# Altium schematic sheet Sensors.SchDoc: IMU Design
size A4; Author: Group 6; DrawnBy: Group 6; Revision: Final Submission; SheetNumber: 1; SheetTotal: 2
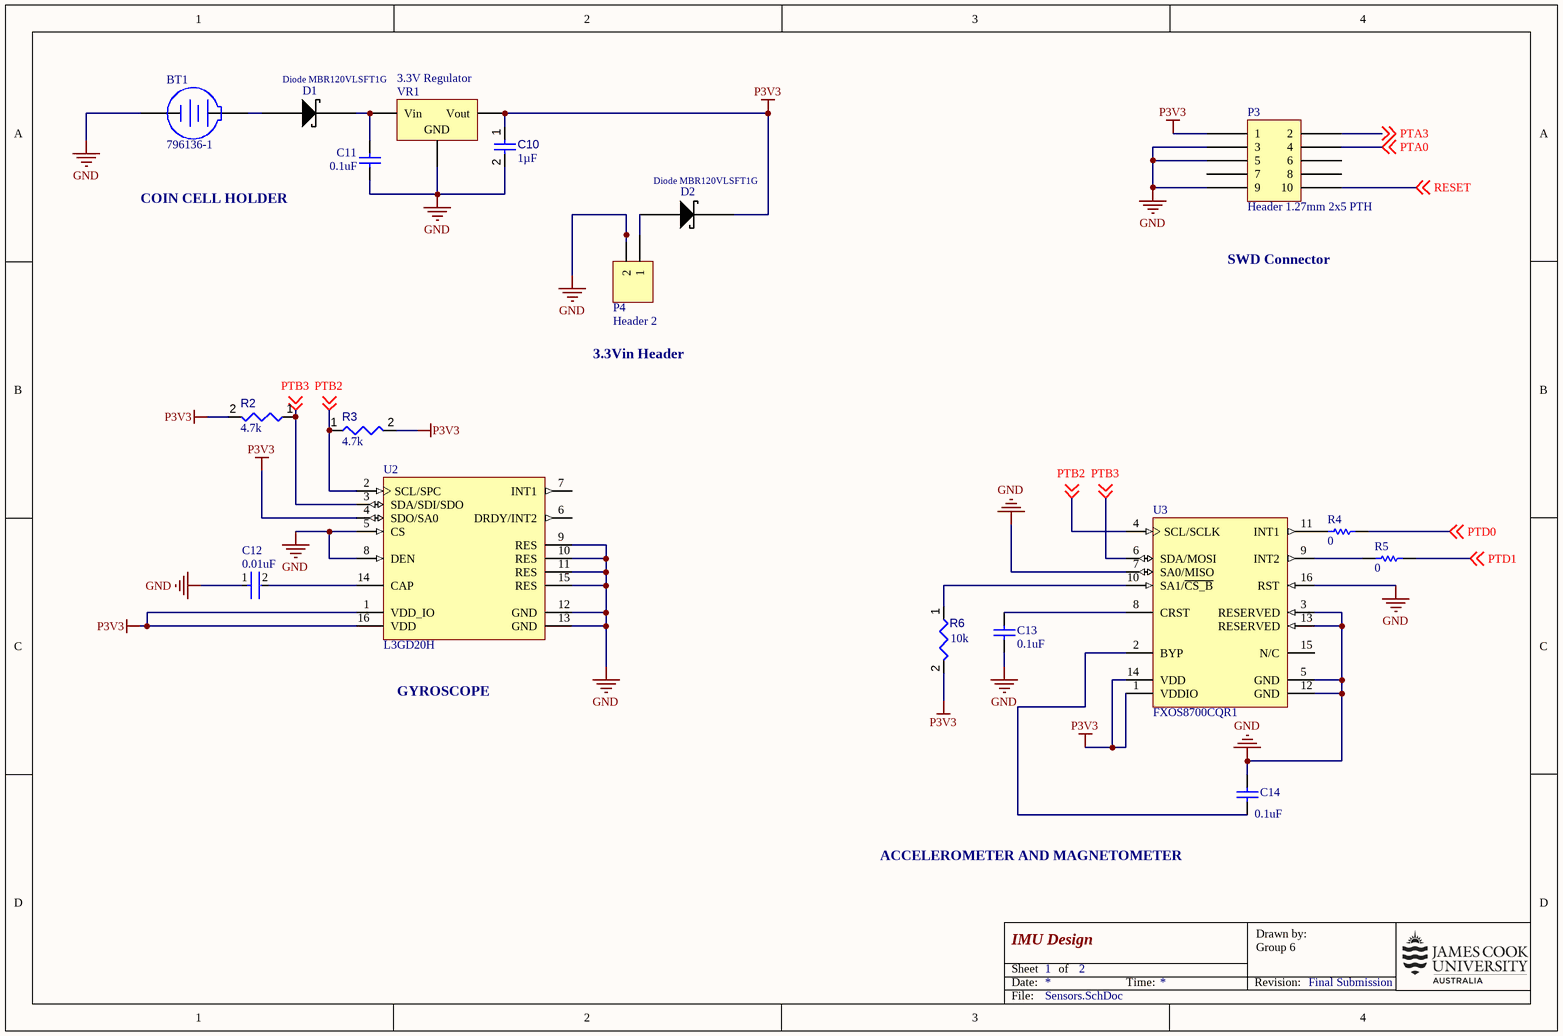
[diagram p0: Sensors.SchDoc]

## Parts
BT1  796136-1  [TECO-796136-1_V]
C10  value 1µF  [CAPC3216X180X20ML20]  (hidden comment: Capacitor 1 uF +/- 10% 25 V 1206)
C11  0.1uF  [CAPC3216X95X55NL15T25]
C12  0.01uF  [FP-C1206C-EB-MFG]
C13  0.1uF  [CAPC3216X95X55NL15T25]
C14  0.1uF  [CAPC3216X95X55NL15T25]
D1  Diode MBR120VLSFT1G  [SODFL360X100-2N]
D2  Diode MBR120VLSFT1G  [SODFL360X100-2N]
P3  Header 1.27mm 2x5 PTH  [Header 1.27mm 2x5 PTH]
P4  Header 2  [HDR1X2]
R2  value 4.7k  [RESC3116X70X50ML13T20]  (hidden comment: Resistor 4k7 +/-1% 1206 250 mW)
R3  value 4.7k  [RESC3116X70X50ML13T20]  (hidden comment: Resistor 4k7 +/-1% 1206 250 mW)
R4  value 0  [RESC3216X60X45ML15T20]  (hidden comment: Resistor 0R +/- 5% 1206 250 mW)
R5  value 0  [RESC3216X60X45ML15T20]  (hidden comment: Resistor 0R +/- 5% 1206 250 mW)
R6  value 10k  [RESC3216X60X45ML15T20]  (hidden comment: Resistor 10k +/-1% 1206 250 mW)
U2  L3GD20H  [STM-LGA-16]
U3  FXOS8700CQR1  [FREE-QFN-16-3000X3000DE_V]
VR1  3.3V Regulator  [D2PAK_N]

## Nets
GND: BT1.2(-) C10.2 C11.2 C12.1 C13.2 C14.2 P3.3 P3.5 P3.9 P4.2 U2.5(CS) U2.8(DEN) U2.9(RES) U2.10(RES) U2.11(RES) U2.12(GND) U2.13(GND) U2.15(RES) U3.3(RESERVED) U3.5(GND) U3.7(SA0/MISO) U3.12(GND) U3.13(RESERVED) U3.16(RST) VR1.2(GND)
P3V3: C10.1 D2.1 P3.1 R2.2 R3.2 R6.2 U2.1(VDD_IO) U2.4(SDO/SA0) U2.16(VDD) U3.1(VDDIO) U3.14(VDD) VR1.3(Vout)
PTA0: P3.4 ; off-sheet PTA0
PTA3: P3.2 ; off-sheet PTA3
PTB2: R3.1 U2.2(SCL/SPC) U3.4(SCL/SCLK) ; off-sheet PTB2
PTB3: R2.1 U2.3(SDA/SDI/SDO) U3.6(SDA/MOSI) ; off-sheet PTB3
PTD0: R4.2 ; off-sheet PTD0
PTD1: R5.2 ; off-sheet PTD1
RESET: P3.10 ; off-sheet RESET
NetBT1_1: BT1.1(+) D1.2
NetC11_1: C11.1 D1.1 VR1.1(Vin)
NetC12_2: C12.2 U2.14(CAP)
NetC13_1: C13.1 U3.8(CRST)
NetC14_1: C14.1 U3.2(BYP)
NetD2_2: D2.2 P4.1
NetR4_1: R4.1 U3.11(INT1)
NetR5_1: R5.1 U3.9(INT2)
NetR6_1: R6.1 U3.10(SA1/~{CS_B})

Not connected (* = marked no-connect by the designer): P3 6 7 8; U2 6(DRDY/INT2) 7(INT1); U3 15(N/C)

## Notes on the sheet
- COIN CELL HOLDER
- SWD Connector
- 3.3Vin Header
- GYROSCOPE
- ACCELEROMETER AND MAGNETOMETER
- Date:
- Sheet
- of
- Time:
- Revision:
- Drawn by:
- File:

## Library data of the parts
BT1 = CMP-002-00002-1: Battery Connector, 1 Cell, CR2032, 2-Pin SMD, RoHS, Tape and Reel; Manufacturer: TE Connectivity; Connector Type: BatteryHolder; Max Voltage Rating (AC): 30V; Batteries: 1; Pins: 2; Package Description: 2-Pin Surface Mount Device, Body 32.31 x 19.05 mm; Package Reference: 796136-1; Mounting Technology: SM; Manufacturer URL: http://www.te.com/; Contact Material: Bronze; Case/Package: 796136-1; Colour: Black; Packaging: TapeandReel; Package Quantity: 400; Datasheet Version: Dec-13; RoHS Compliant: True; Datasheet URL: http://www.te.com/commerce/DocumentDelivery/DDEController?Action=srchrtrv&DocNm=796136&DocType=Customer+Drawing&DocLang=English&DocFormat=pdf&PartCntxt=796136-1; Contact Plating: Tin
C10 = CMP-001-00006-4: Chip Capacitor, 1 uF, +/- 10%, 25 V, 1206 (3216 Metric); Voltage Rating: 25V; Capacitor Type: Ceramic; RoHS Compliant: True; Pins: 2; Min Operating Temperature: -55°C; Mounting Technology: SM; Max Operating Temperature: 125°C; Tolerance: 10%; Case/Package: 1206
C11 C13 C14 = CMP-1662-00007-4: Chip Capacitor, 0.1 uF, +/- 10%, 50 V, -55 to 125 degC, 1206 (3216 Metric), RoHS, Tape and Reel; Manufacturer: Murata; Voltage Rating: 50 V; Lead Pitch: 4 mm; PackageDescription: 2-Pin Surface Mount Device, Body 3.2 x 1.6 mm; DatasheetVersion: 03/2016; Min Operating Temperature: -55 degC; Package Quantity: 4000; RoHSCompliant: true; Max Operating Temperature: 125 degC; Height: 0.85 mm; Pins: 2; Length: 3.2 mm; PackageReference: 1206 (3216 Metric); Mounting Technology: Surface Mount; ComponentLink1Description: Manufacturer URL; ComponentLink2Description: Datasheet; ComponentLink1URL: http://www.murata.com/; Mount: Surface Mount; REACH SVHC: No SVHC; Packaging: Tape and Reel; ComponentLink2URL: http://search.murata.co.jp/Ceramy/image/img/A01X/G101/ENG/GRM319R71H104KA01-01.pdf
C12 = CMP-03020-010077-1: CAP CER 10000PF 200V X7R 1206; Manufacturer: KEMET; Manufacturer Part Number: C1206C103K2RACTU; Value: 10,000 pF; Automotive Grade: Grade 0; Temperature Coefficient: 15%; Material: Ceramic; Tolerance: 0.1; Temperature Range High: +150°C; Category: Cap; Device Class L2: Capacitors; Temperature Range Low: -55°C; Temperature Characteristic: X7R; Lead Free: Yes; Octopart: https://octopart.com/c1206c103k2ractu-kemet-2299149; Device Class L1: Passive Components; RoHS: TRUE; Mouser Description: Multilayer Ceramic Capacitors MLCC - SMD/SMT 200volts 10000pF X7R 10%; Temperature: -55°C to +150°C; Voltage Rating: 200 V; ComponentLink2URL: https://content.kemet.com/datasheets/KEM_C1007_X8R_ULTRA_150C_SMD.pdf; Ipc Land Pattern Name: CAPC320160X78; Automotive: Yes; Device Class L3: Ceramic Capacitors; Digikey Description: CAP CER 10000PF 200V X7R 1206; Capacitance: 10,000 pF; Package: C1206C-EB; ComponentLink2Description: Datasheet; Height: 0.88mm
D1 D2 = CMP-007-0001-1: MBR120VLSFT1G Schottky Rectifier, 20V, 1A; Component Type: Standard; Pins: 2; Design Item ID: Diode MBR120VLSFT1G; Source: JCULibrary.SchLib
P3 = CMP-005-0002-1: Header 1.27mm pitch, 2x5, PTH through hole; Pins: 10; Design Item ID: Header 1.27mm 2x5 PTH; Source: JCULibrary.SchLib; Component Type: Standard
P4 = Header 2: Header, 2-Pin; LatestRevisionDate: 17-Jul-2002; LatestRevisionNote: Re-released for DXP Platform.; Publisher: Altium Limited
R2 R3 = CMP-009-00033-4: Chip Resistor, 4.7 KOhm, +/- 1%, 0.25 W, -55 to 155 degC, 1206 (3216 Metric); Voltage Rating: 200V; Power: 250mW; Tolerance: 1%; Mounting Technology: SM; Max Operating Temperature: 155°C; Case/Package: 1206; RoHS Compliant: True; Min Operating Temperature: -55°C; Pins: 2
R4 R5 = CMP-009-00002-4: Chip Resistor, 0 Ohm, +/- 5%, 0.25 W, -55 to 155 degC, 1206 (3216 Metric); Voltage Rating: 200V; Power: 250mW; Case/Package: 1206; Mounting Technology: SM; RoHS Compliant: True; Min Operating Temperature: -55°C; Max Operating Temperature: 155°C; Tolerance: 5%; Pins: 2
R6 = CMP-009-00016-4: Chip Resistor, 10 KOhm, +/- 1%, 0.25 W, -55 to 155 degC, 1206 (3216 Metric); Power: 250mW; Voltage Rating: 200V; Max Operating Temperature: 155°C; Mounting Technology: SM; Case/Package: 1206; Pins: 2; Min Operating Temperature: -55°C; RoHS Compliant: True; Tolerance: 1%
U2 = CMP-1771-00002-2: MEMS Motion Sensor: Three-Axis Digital Output Gyroscope, 2.2 to 3.6 V, -40 to 85 degC, 16-Pin LGA, RoHS, Tray; ESR: 200 Ohm; Load Capacitance: 18 pF; Capacitance: 1.8E-11 f; Frequency: 8 MHz; Frequency Tolerance: 20ppm; DatasheetVersion: Rev. 2, 03/2013; ComponentLink1Description: Manufacturer URL; Length: 0.197 inch; Mount: Surface Mount; REACH SVHC: Unknown; ComponentLink2URL: http://www.st.com/content/ccc/resource/technical/document/datasheet/35/b1/e0/39/71/57/43/01/DM00060659.pdf/files/DM00060659.pdf/jcr:content/translations/en.DM00060659.pdf; Min Operating Temperature: -20degC; Height: 0.043 inch; Max Operating Temperature: 70degC; ComponentLink1URL: http://www.st.com/; Case/Package: CSMD; Packaging: Tape and Reel; Width: 0.126 inch; Resistance: 200 Ohm; ComponentLink2Description: Datasheet; Package Quantity: 1000; RoHSCompliant: True; Pins: 4; Tolerance: 20ppm; PackageReference: LGA-16; PackageDescription: 16-Pin Land Grid Array Package, Body 3 x 3 mm, Pitch 0.5 mm
U3 = CMP-2000-05129-1: 6-Axis Xtrinsic Sensor with Integrated Linear Accelerometer and Magnetometer, 1.95 to 3.6 V, -40 to 85 degC, 16-Pin QFN, RoHS, Tape and Reel; Manufacturer: Freescale; Supply Voltage - Min: 1.95V; Operating Supply Voltage: 1.95Vto3.6V; Unit Weight: 0.000808oz; Supply Voltage - Max: 3.6V; Brand: FreescaleSemiconductor; Sensing Axis: X,Y,Z; Output Type: Digital; Package / Case: QFN-16; Datasheet Version: Rev. 1, 06/2012; Factory Pack Quantity: 1000; Mounting Style: SMD/SMT; Datasheet URL: https://datasheet.ciiva.com/12175/fxos8700cq-60595-12175213.pdf; Type: 6AxisSensor; Maximum Operating Temperature: +85C; Manufacturer URL: http://www.nxp.com/; Package Description: 16-Pin Quad Flat No-lead Package, Body 3 x 3 mm, Pitch 0.5 mm; RoHS: Details; Package Reference: QFN-16; Tradename: Xtrinsic; Packaging: Reel; Minimum Operating Temperature: -40C; Product Category: BoardMountAccelerationSensors
VR1 = Volt Reg: Voltage Regulator; Published: 24-Mar-1999; LatestRevisionDate: 29-May-2009; LatestRevisionNote: IPC-7351 Footprint Added.; PackageReference: D2PAK; Publisher: Altium Limited; PackageDescription: 3-Pin Transistor Outline Package 2.54 mm Pitch, 15.1 mm Lead Span